# Altium schematic sheet input stage.SchDoc
size B
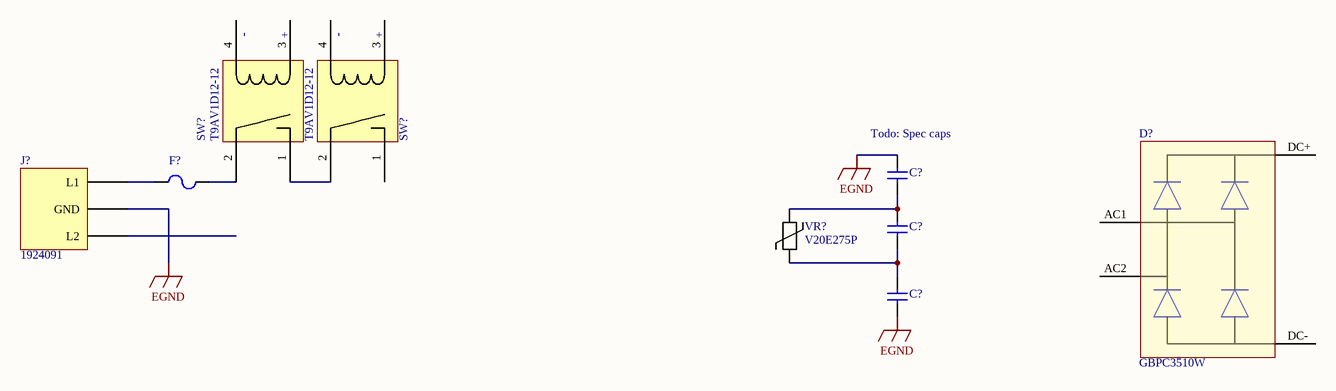
[diagram p0: input stage.SchDoc]

## Parts
(Parts that share a designator on the sheet are numbered #1, #2 ... from top to bottom, then left to right.)
C?#1  CAP 1206  [1206_CAPACITOR]  (value not drawn)
C?#2  CAP 1206  [1206_CAPACITOR]  (value not drawn)
C?#3  CAP 1206  [1206_CAPACITOR]  (value not drawn)
D?  PN: GBPC3510W  [UPTB15E3/TR7]  (hidden comment: Short Part Description)
F?  F_3101.0040  [FPG4 Fuseholder]  (value not drawn)
J?  PN: 1924091  (hidden comment: J_1924091)
SW?#1  PN: T9AV1D12-12  [EV200]  (hidden comment: SW_T9AV1D12-12)
SW?#2  PN: T9AV1D12-12  [EV200]  (hidden comment: SW_T9AV1D12-12)
VR?  V20E275P  [ERZ-V20R201]

## Nets
EGND: C?#1.1 C?#3.2 J?.GND
NetC?#1_2: C?#1.2 C?#2.1 VR?.1
NetC?#2_2: C?#2.2 C?#3.1 VR?.2
NetF?_1: F?.1 J?.L1
NetF?_2: F?.2 SW?#1.2
NetSW?#1_1: SW?#1.1 SW?#2.2

Not connected (* = marked no-connect by the designer): D? AC1 AC2 DC+ DC-; J? L2; SW?#1 3(+) 4; SW?#2 1 3(+) 4

## Notes on the sheet
- (near C?#1) Todo: Spec caps
- (in symbol SW_T9AV1D12-12) -

## Library data of the parts
C?#1-C?#3 = C_1206: CAP CERM 1206; Known Distributors: Digikey; Package: 1206
D? = D_GBPC3510W: RECT BRIDGE GPP 35A 1000V GBPC-W; MFG: Fairchild Semiconductor
F? = F_3101.0040: Schurter FPG4 5mm x 20mm Fuse Holder; Dist PN: 486-1159-ND; Distributor: Digikey; Datasheet: http://www.schurterinc.com/var/schurter/storage/ilcatalogue/files/document/datasheet/en/pdf/typ_FPG4.pdf
J? = J_1924091: CONN HEADER 3POS 5.08MM; MFG: Phoenix Contact
SW?#1 SW?#2 = SW_T9AV1D12-12: RELAY GEN PURPOSE SPST 30A 12V; MFG: TE Connectivity
VR? = VR_V20E275P: 200V 100J Varistor; MFG: Littelfuse Inc; PN: V20E275P